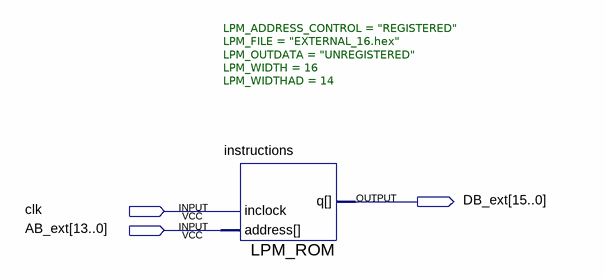
[diagram p0: schematic sheet]
// Quartus schematic EXTERNAL.bdf as structural Verilog: 1 symbols, 3 pins
module EXTERNAL (
  input  clk,
  input  [13:0] AB_ext,
  output [15:0] DB_ext
);

  LPM_ROM #(.LPM_ADDRESS_CONTROL("REGISTERED"), .LPM_FILE("EXTERNAL_16.hex"), .LPM_OUTDATA("UNREGISTERED"), .LPM_WIDTH(16), .LPM_WIDTHAD(14)) instructions (
    .address(AB_ext), .inclock(clk), .q(DB_ext));
endmodule
